# Altium schematic sheet [6]-OPI_POWER.SchDoc
size A4
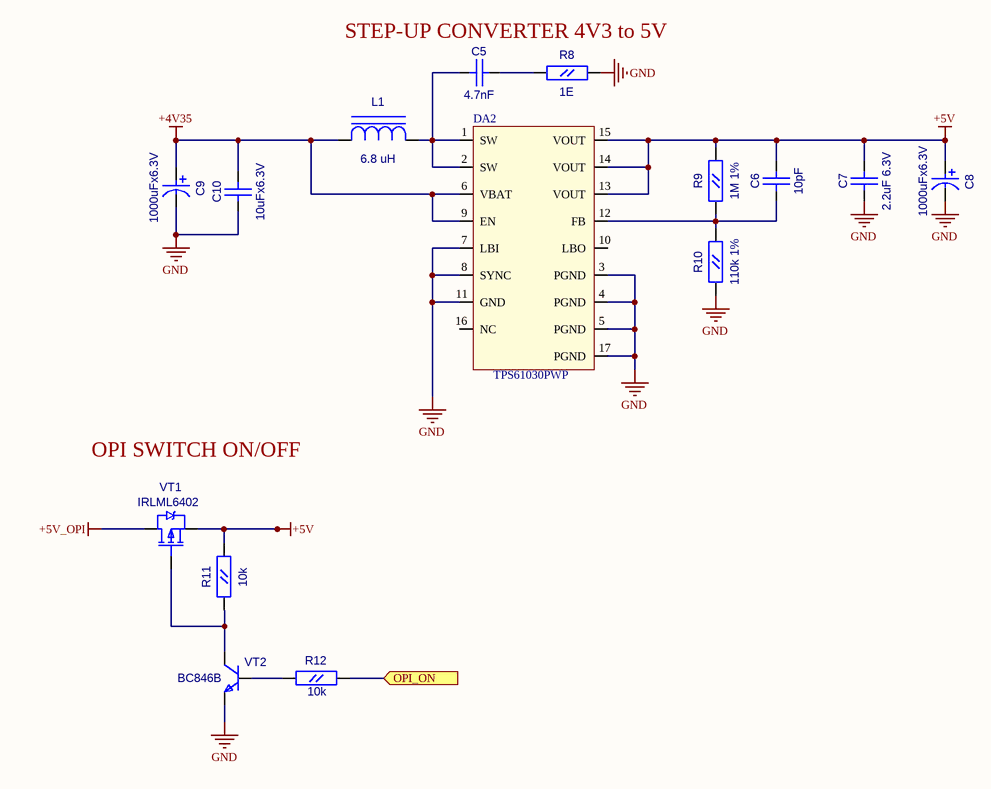
[diagram p0: [6]-OPI_POWER.SchDoc]

## Parts
C5  4.7nF  [CC0603]
C6  10pF  [CC0603]
C7  2.2uF 6.3V  [CC0805]
C8  value 1000uFx6.3V  [CC8X3.5]  (hidden comment: CAP0.35)
C9  value 1000uFx6.3V  [CC8X3.5]  (hidden comment: CAP0.35)
C10  10uFx6.3V  [CC0805]
DA2  TPS61030PWP  [R-PDSO-G16]
L1  6.8 uH  [SDR0805]
R8  1E  [RC0603]
R9  1M 1%  [RC0603]
R10  110k 1%  [RC0603]
R11  10k  [RC0603]
R12  10k  [RC0603]
VT1  IRLML6402  [SOT-23(123)]
VT2  BC846B  [SOT-23(123)]

## Ports
OPI_ON (in)

## Nets
+4V35: C9.1 C10.2(B) DA2.6(VBAT) DA2.9(EN) L1.1(C)
+5V: C6.2(B) C7.2(B) C8.1 DA2.13(VOUT) DA2.14(VOUT) DA2.15(VOUT) R9.2(B) R11.2(B) VT1.2(S)
+5V_OPI: VT1.3(D)
GND: C7.1(A) C8.2 C9.2 C10.1(A) DA2.3(PGND) DA2.4(PGND) DA2.5(PGND) DA2.7(LBI) DA2.8(SYNC) DA2.11(GND) DA2.17(PGND) R8.2(B) R10.1(A) VT2.2(E)
OPI_ON: R12.2(B) ; port OPI_ON
NetC5_1: C5.1(A) DA2.1(SW) DA2.2(SW) L1.2(A)
NetC5_2: C5.2(B) R8.1(A)
NetC6_1: C6.1(A) DA2.12(FB) R9.1(A) R10.2(B)
NetR11_1: R11.1(A) VT1.1(G) VT2.3(C)
NetR12_1: R12.1(A) VT2.1(B)

Not connected (* = marked no-connect by the designer): DA2 10(LBO) 16(NC)

## Notes on the sheet
- STEP-UP CONVERTER 4V3 to 5V
- OPI SWITCH ON/OFF

## Library data of the parts
C5 C6 = CC0603
  C5: Value: 4.7nF
  C6: Value: 10pF
C7 C10 = CC0805
  C7: Value: 2.2uF 6.3V
  C10: Value: 10uFx6.3V
DA2 = TPS61030PWP: Boost converter
L1 = SDR0805: Value: 6.8 uH
R8-R12 = RC0603
  R8: Value: 1E
  R9: Value: 1M 1%
  R10: Value: 110k 1%
  R11 R12: Value: 10k
VT1 = IRLML6402: HEXFET Power MOSFET; OriginalName: IRLML5103; ComponentField7: Published 8-Jun-2000; Value: IRLML6402
VT2 = BC846BLT1: ComponentField7: Published 29-Sep-2000; OriginalName: BC846BLT1; Value: BC846B